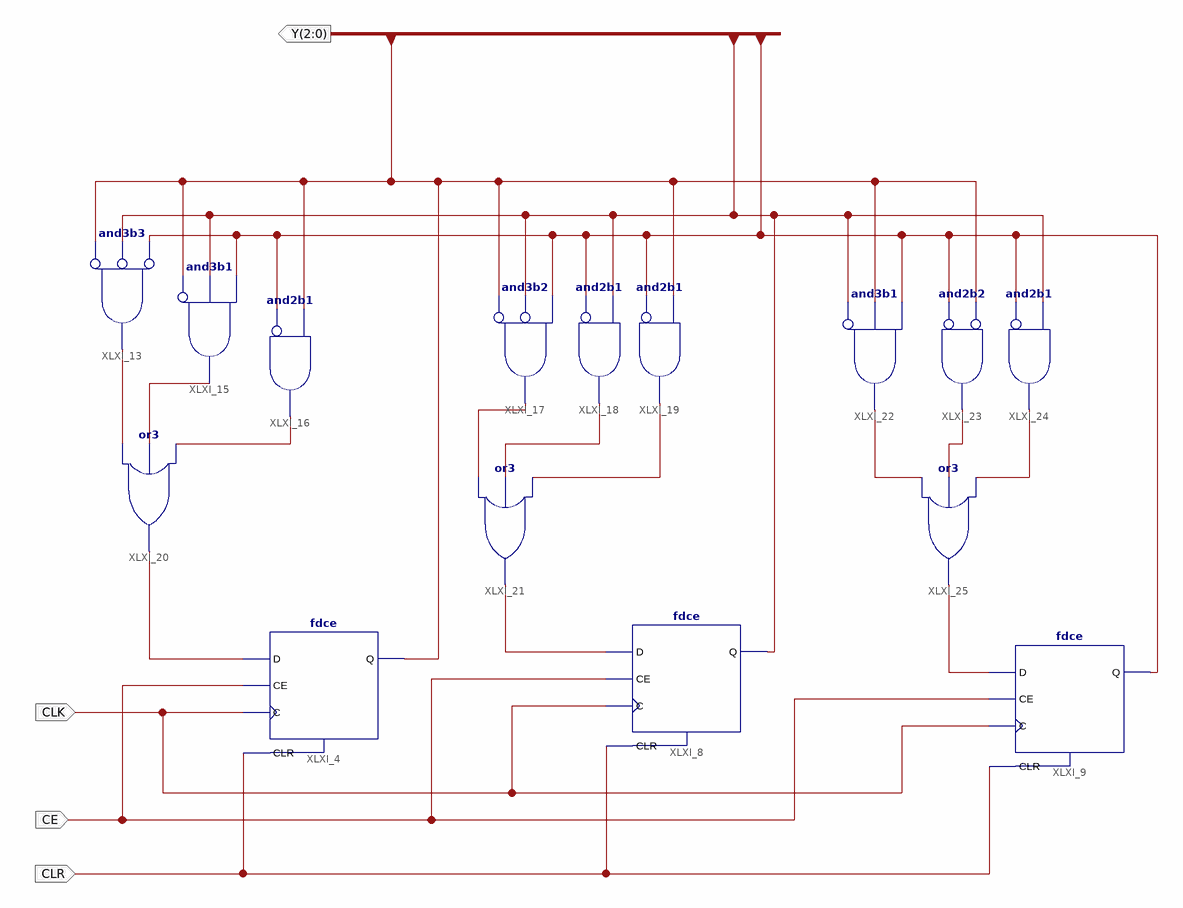
[diagram p0: schematic sheet 1]
// Xilinx ISE schematic schemat.sch (xc9500xl) as structural Verilog: 15 symbols, 4 ports
module schemat (
  input  CLK,
  input  CLR,
  input  CE,
  output [2:0] Y
);

  wire XLXN_36, XLXN_38, XLXN_45, XLXN_49, XLXN_50, XLXN_51, XLXN_52, XLXN_53, XLXN_59, XLXN_60, XLXN_61,
       XLXN_63;

  fdce XLXI_4 (.C(CLK), .CE(CE), .CLR(CLR), .D(XLXN_49), .Q(Y[2]));
  fdce XLXI_8 (.C(CLK), .CE(CE), .CLR(CLR), .D(XLXN_53), .Q(Y[1]));
  fdce XLXI_9 (.C(CLK), .CE(CE), .CLR(CLR), .D(XLXN_63), .Q(Y[0]));
  and XLXI_13 (XLXN_36, ~Y[2], ~Y[1], ~Y[0]);  // and3b3
  and XLXI_15 (XLXN_38, ~Y[2], Y[1], Y[0]);  // and3b1
  and XLXI_16 (XLXN_45, ~Y[0], Y[2]);  // and2b1
  and XLXI_17 (XLXN_50, ~Y[2], ~Y[1], Y[0]);  // and3b2
  and XLXI_18 (XLXN_51, ~Y[0], Y[1]);  // and2b1
  and XLXI_19 (XLXN_52, ~Y[0], Y[2]);  // and2b1
  or XLXI_20 (XLXN_49, XLXN_36, XLXN_38, XLXN_45);
  or XLXI_21 (XLXN_53, XLXN_50, XLXN_51, XLXN_52);
  and XLXI_22 (XLXN_59, ~Y[1], Y[2], Y[0]);  // and3b1
  and XLXI_23 (XLXN_60, ~Y[0], ~Y[2]);  // and2b2
  and XLXI_24 (XLXN_61, ~Y[0], Y[1]);  // and2b1
  or XLXI_25 (XLXN_63, XLXN_59, XLXN_60, XLXN_61);
endmodule
